# EAGLE design batoncircuit (EAGLE 7.1.0)
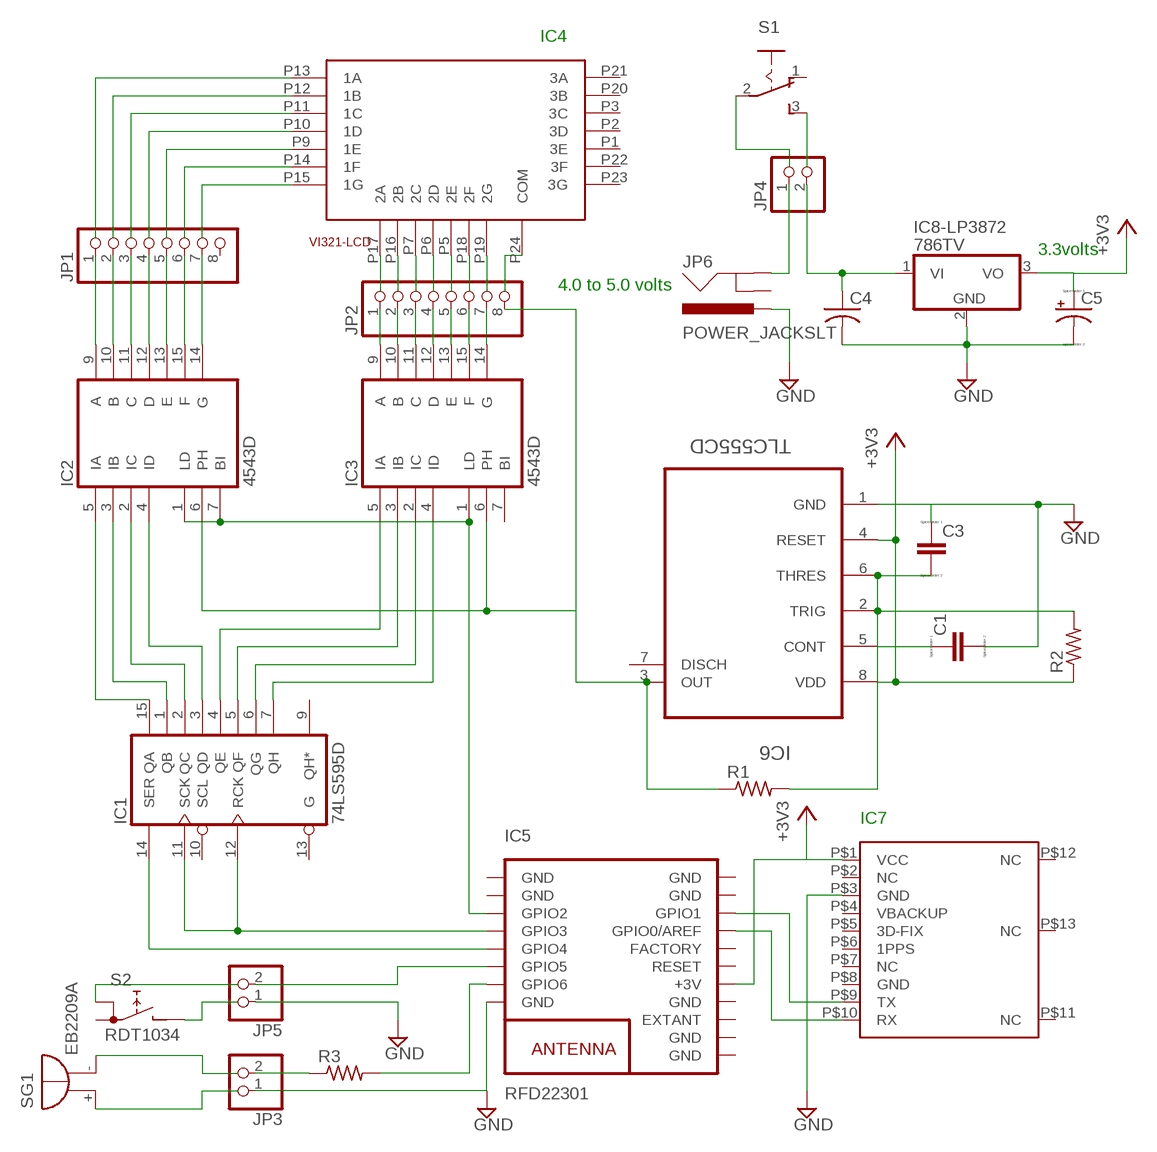
[diagram p0: schematic, sheet 1]

## Parts
C1  C-EU075-063X106  [C075-063X106]
C3  C-EUC1812  [C1812]
C4  C-US050-045X075  [C050-045X075]
C5  CPOL-USE5-10.5  [E5-10,5]
IC1  74LS595D  [SO16]
IC2  4543D  [SO16]
IC3  4543D  [SO16]
IC5  RFD22301  [RFD22301]
IC6  TLC555CD  [SOIC127P600X175-8N]
IC7  GPS_FGPMMOPA6C  [FGPMMOPA6C]
IC8-LP3872  786TV  [TO220V]
JP1  PINHD-1X8  [1X08]
JP2  PINHD-1X8  [1X08]
JP3  PINHD-1X2  [1X02]
JP4  PINHD-1X2  [1X02]
JP5  PINHD-1X2  [1X02]
JP6  POWER_JACKSLT  [POWER_JACK_SLOT]
R1  R-US_0207/10  [0207/10]
R2  R-US_0207/10  [0207/10]
R3  R-US_0207/12  [0207/12]
S1  255SB  [255SB]
S2  RDT1034  [RDT1034]
SG1  EB2209A  [EB2209A]
U8  V321-3DIGIT-LCD  [VI321-3DIGIT-LCD]

## Nets
+3V3: IC5.13(+3V) IC6.4(RESET) IC6.8(VDD) IC7.P$1(VCC) R2.1
GND: C1.2 C3.1 C4.2 C5.- IC5.8(GND) IC6.1(GND) IC7.P$3(GND) IC8-LP3872.2(GND) JP3.1 JP5.1 JP6.PWR
N$1: IC2.9(A) JP1.1
N$2: IC2.10(B) JP1.2
N$3: IC2.11(C) JP1.3
N$4: IC2.12(D) JP1.4
N$5: IC2.13(E) JP1.5
N$6: IC2.15(F) JP1.6
N$7: IC2.14(G) JP1.7
N$8: U8.P19(2G)
N$9: U8.P18(2F)
N$10: U8.P5(2E)
N$11: U8.P6(2D)
N$12: U8.P7(2C)
N$13: U8.P16(2B)
N$14: U8.P17(2A)
N$15: IC1.15(QA) IC2.5(IA)
N$16: IC1.1(QB) IC2.3(IB)
N$17: IC1.2(QC) IC2.2(IC)
N$18: IC1.3(QD) IC2.4(ID)
N$19: IC1.7(QH) IC3.4(ID)
N$20: IC1.6(QG) IC3.2(IC)
N$21: IC1.5(QF) IC3.3(IB)
N$22: IC1.4(QE) IC3.5(IA)
N$23: IC2.6(PH) IC3.6(PH) IC6.3(OUT) JP2.8 R1.1
N$24: IC1.14(SER) IC5.5(GPIO4)
N$25: C1.1 IC6.5(CONT)
N$26: IC5.16(GPIO0/AREF) IC7.P$10(RX)
N$27: C3.2 IC6.2(TRIG) IC6.6(THRES) R1.2 R2.2
N$28: IC5.17(GPIO1) IC7.P$9(TX)
N$29: IC2.1(LD) IC2.7(BI) IC3.1(LD) IC5.3(GPIO2)
N$30: JP3.2 R3.1
N$31: C4.1 IC8-LP3872.1(VI) JP4.2
N$32: IC5.7(GPIO6) R3.2
N$33: SG1.-
N$34: IC1.11(SCK) IC1.12(RCK) IC5.4(GPIO3)
N$35: U8.P24(COM)
N$36: IC3.14(G) JP2.7
N$37: IC3.15(F) JP2.6
N$38: IC3.13(E) JP2.5
N$39: IC3.12(D) JP2.4
N$40: IC3.11(C) JP2.3
N$41: IC3.10(B) JP2.2
N$42: IC3.9(A) JP2.1
N$43: U8.P13(1A)
N$44: U8.P12(1B)
N$45: U8.P11(1C)
N$46: U8.P10(1D)
N$47: U8.P9(1E)
N$48: U8.P14(1F)
N$49: U8.P15(1G)
N$50: SG1.+
N$51: C5.+ IC8-LP3872.3(VO)
N$52: JP4.1 JP6.GND@2(GND)
N$53: S1.3(S)
N$54: S1.2(P)
N$55: IC5.6(GPIO5) JP5.2
N$56: S2.B
N$57: S2.A
Unconnected: IC1.9(QH*) IC1.10(SCL) IC1.13(G) IC3.7(BI) IC5.11(EXTANT) IC5.14(RESET) IC5.15(FACTORY) IC6.7(DISCH) IC7.P$2(NC) IC7.P$4(VBACKUP) IC7.P$5(3D-FIX) IC7.P$6(1PPS) IC7.P$7(NC) IC7.P$8(GND) IC7.P$11(NC) IC7.P$12(NC) IC7.P$13(NC) JP1.8 JP6.GND@1(GNDBREAK) S1.1(O) S2.A1 U8.P1(3E) U8.P2(3D) U8.P3(3C) U8.P20(3B) U8.P21(3A) U8.P22(3F) U8.P23(3G)

## Notes on the sheet
- IC4
- 3.3volts
- 4.0 to 5.0 volts
- IC7

## Power pins joined to a net without a drawn wire
GND: IC1.8(GND) IC5.1(GND) IC5.2(GND) IC5.9(GND) IC5.10(GND) IC5.12(GND) IC5.18(GND) IC5.19(GND)
VCC: IC1.16(VCC)
VDD: IC2.16(VDD) IC3.16(VDD)
VSS: IC2.8(VSS) IC3.8(VSS)

## Library data of the parts
C1 C3 = resistor:C-EU: CAPACITOR, European symbol; SPICEPREFIX: C
C4 = resistor:C-US: CAPACITOR, American symbol
C5 = resistor:CPOL-US: POLARIZED CAPACITOR, American symbol
IC1 = 74xx-us:74*595: 8-bit SHIFT REGISTER, output latch
IC2 IC3 = 45xx:4543: BCD to 7-segment LCD DECODER
IC5 = RF_Digital_RFD22301_Eagle_Schematic_PCB_Library:RFD22301: RFD22301 RFduino SMT Module RFD22301 Datasheet: http://www.rfdigital.com/wp-content/uploads/2014/03/RFD22301.Data_.Sheet_.11.24.13_11.38PM.pdf
IC6 = Texas Instruments_By_element14_Batch_1:TLC555CD: LINCMOS TIMER; MPN: TLC555CD; OC_FARNELL: 1106128; OC_NEWARK: 67K1265; PACKAGE: SOIC-8; SUPPLIER: Texas Instruments
IC7 = adafruit:GPS_FGPMMOPA6C: FGPMMOPA6C 16x16 GPS Module NMEA Sentences: GGA, GSA, GSV, RMC, VTG
IC8-LP3872 = linear:78*: Positive VOLTAGE REGULATOR Source: http://cache.national.com/ds/LM/LM78L05.pdf http://www.fairchildsemi.com/ds/LM/LM7805.pdf
JP1 JP2 = pinhead:PINHD-1X8: PIN HEADER
JP3-JP5 = pinhead:PINHD-1X2: PIN HEADER
JP6 = SparkFun-Connectors:POWER_JACK: Power Jack This is the standard 5.5mm barrel jack for power. The PTH is the most common, proven, reliable, footprint. The Slot footprint only works if the mill layer is transmitted to the PCB fab house so be warned. Mating wall wart : TOL-00298 (and others); PROD_ID: PRT-00119
R1-R3 = resistor:R-US_: RESISTOR, American symbol
S1 = switch:255SB: SLIDING SWITCH Distributor Buerklin, 11G810
S2 = switch:RDT1034: PUSH SWITCH www.radiohm.com
SG1 = buzzer:EB2209A: BUZZER Source: Buerklin
U8 = vi321lcd:V321-3DIGIT-LCD

## Board
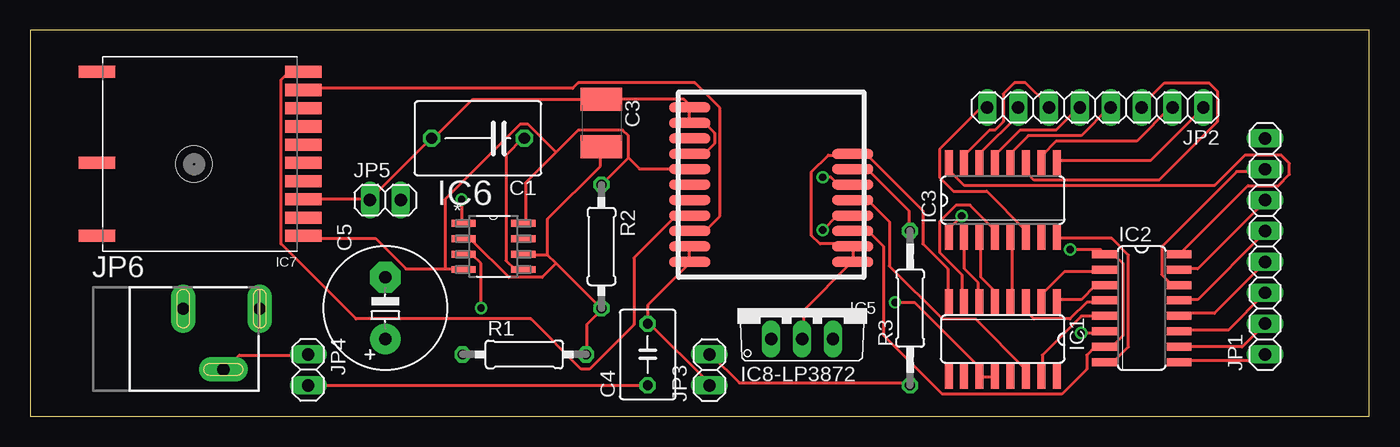
[diagram p1: board, top side]
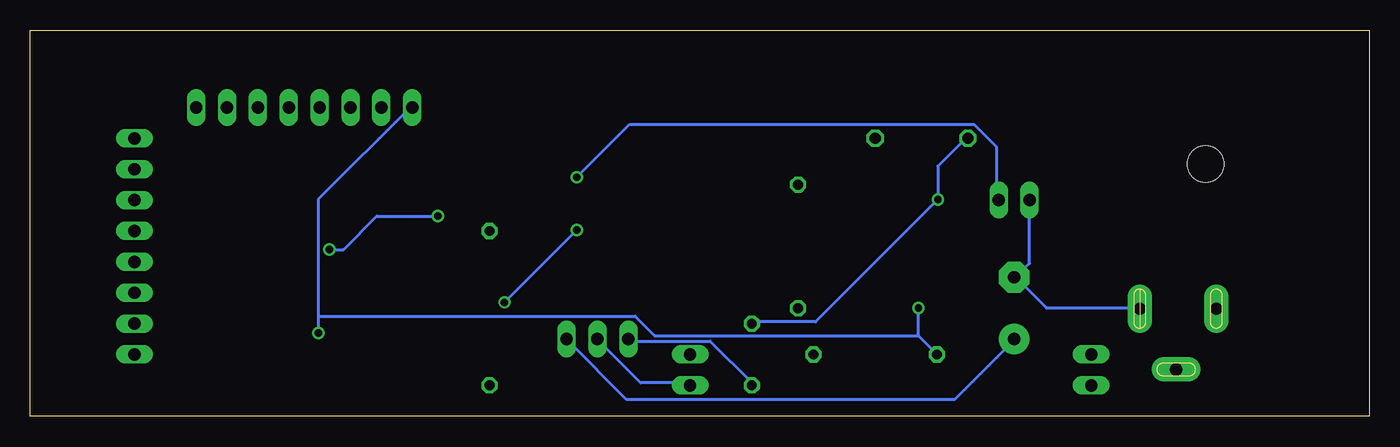
[diagram p2: board, bottom side, seen from below]

Size 110.16 x 31.74 mm. Coordinates in mm from the lower left corner, seen from the top.
Outline: 0,0 110.16,0 110.16,31.74 0,31.74 0,0
Copper layers (1*16): Top 0.035mm / dielectric 1.5mm / Bottom 0.035mm
Design rules "default": minimum track width 10mil, minimum drill 24mil, track to track 8mil, track to pad 8mil, pad to pad 8mil, via to via 8mil, smd to smd 8mil, copper to edge 40mil, drill to drill 8mil, minimum pad ring 10mil, minimum via ring 8mil, stop-mask expansion 4mil, vias tented up to drill 0mil, thermal gap 10mil

### Footprints (pad centres in the part's own frame; a part is rotated, then mirrored left to right if it is on the bottom)
C075-063X106 = drill 0.914 octagon: 1 -3.81,0; 2 3.81,0
C1812 = smd 1.9 x 3.4: 1 -1.95,0; 2 1.95,0
C050-045X075 = drill 0.813 octagon: 1 -2.54,0; 2 2.54,0
E5-10,5 = drill 1.016 pad 2.54: + -2.54,0 | drill 1.016 pad 2.54 octagon: - 2.54,0
SO16 = smd 0.66 x 2.032: 1 -4.445,-3.073; 2 -3.175,-3.073; 3 -1.905,-3.073; 4 -0.635,-3.073; 5 0.635,-3.073; 6 1.905,-3.073; 7 3.175,-3.073; 8 4.445,-3.073; 9 4.445,3.073; 10 3.175,3.073; 11 1.905,3.073; 12 0.635,3.073; 13 -0.635,3.073; 14 -1.905,3.073; 15 -3.175,3.073; 16 -4.445,3.073
RFD22301 = smd 3.353 x 0.813: 1 -6.706,7.62; 2 -6.706,6.35; 3 -6.706,5.08; 4 -6.706,3.81; 5 -6.706,2.54; 6 -6.706,1.27; 7 -6.706,0; 8 -6.706,-1.27; 9 6.706,-5.08; 10 6.706,-3.81; 11 6.706,-2.54; 12 6.706,-1.27; 13 6.706,0; 14 6.706,1.27; 15 6.706,2.54; 16 6.706,3.81; 17 6.706,5.08; 18 6.706,6.35; 19 6.706,7.62
SOIC127P600X175-8N = smd 1.981 x 0.559: 1 -2.464,1.905; 2 -2.464,0.635; 3 -2.464,-0.635; 4 -2.464,-1.905; 5 2.464,-1.905; 6 2.464,-0.635; 7 2.464,0.635; 8 2.464,1.905
FGPMMOPA6C = smd 3 x 1: P$1 -8.5,6.75; P$2 -8.5,5.25; P$3 -8.5,3.75; P$4 -8.5,2.25; P$5 -8.5,0.75; P$6 -8.5,-0.75; P$7 -8.5,-2.25; P$8 -8.5,-3.75; P$9 -8.5,-5.25; P$10 -8.5,-6.75; P$11 8.5,-6.75; P$12 8.5,0.75; P$13 8.5,6.75 | hole 3: 0.5,0.85
TO220V = drill 1.016 long: 1 -2.54,-2.54; 2 0,-2.54; 3 2.54,-2.54
1X08 = drill 1.016 long: 1 -8.89,0; 2 -6.35,0; 3 -3.81,0; 4 -1.27,0; 5 1.27,0; 6 3.81,0; 7 6.35,0; 8 8.89,0
1X02 = drill 1.016 long: 1 -1.27,0; 2 1.27,0
POWER_JACK_SLOT = drill 1 pad 2 long: GND@1 2.58,7.5; GND@2 7.58,10.8; PWR 2.58,13.8
0207/10 = drill 0.813 octagon: 1 -5.08,0; 2 5.08,0
0207/12 = drill 0.813 octagon: 1 -6.35,0; 2 6.35,0
255SB = drill 1.118 long: 1 -3.81,0; 2 0,0; 3 3.81,0
RDT1034 = drill 0.8: A 3.175,-0.635; A1 -3.175,0.635; B 0.65,1.9
EB2209A = drill 1.321 pad 2.54 octagon: + 7.493,0; - -7.493,0
VI321-3DIGIT-LCD = drill 0.8: P1 -13.97,-10.795; P2 -11.43,-10.795; P3 -8.89,-10.795; P4 -6.35,-10.795; P5 -3.81,-10.795; P6 -1.27,-10.795; P7 1.27,-10.795; P8 3.81,-10.795; P9 6.35,-10.795; P10 8.89,-10.795; P11 11.43,-10.795; P12 13.97,-10.795; P13 13.97,10.795; P14 11.43,10.795; P15 8.89,10.795; P16 6.35,10.795; P17 3.81,10.795; P18 1.27,10.795; P19 -1.27,10.795; P20 -3.81,10.795; P21 -6.35,10.795; P22 -8.89,10.795; P23 -11.43,10.795; P24 -13.97,10.795

### Placement (x,y rotation side)
C1  36.83,22.86 180 top
C3  46.99,24.13 270 top
C4  50.8,5.08 90 top
C5  29.21,8.89 90 top
IC1  80.01,6.35 180 top
IC2  91.44,8.89 270 top
IC3  80.01,17.78 0 top
IC5  60.96,20.32 180 top
IC6  38.1,13.97 0 top
IC7  13.97,21.59 180 top
IC8-LP3872  63.5,8.89 0 top
JP1  101.6,13.97 90 top
JP2  87.63,25.4 180 top
JP3  55.88,3.81 90 top
JP4  22.86,3.81 270 top
JP5  29.21,17.78 0 top
JP6  5.08,11.43 270 top
R1  40.64,5.08 0 top
R2  46.99,13.97 270 top
R3  72.39,8.89 90 top
S1  38.1,48.26 90 top  (outside the outline)
S2  50.8,48.26 0 top  (outside the outline)
SG1  16.51,48.26 0 top  (outside the outline)
U8  83.82,50.8 0 top  (outside the outline)

### Tracks (layer width: path | path; a pad name or v marks a point on that pad's centre or on a via)
+3V3
  Top 0.254: 34.11,12.12 30.91,12.12 28.4,14.63 22.68,14.63 IC7.P$1 | 34.11,12.12 35.48,12.12 IC6.4 | 43.26,21.72 45.09,23.55 48.74,23.55 49.2,23.09 49.2,21.26 | 43.26,21.72 40.74,19.2 40.74,16 IC6.8 | R2.1 49.2,21.26 | 49.2,21.26 50.11,20.34 54.23,20.34 IC5.13 | 34.11,12.12 34.11,17.83 40.28,24 40.97,24 43.26,21.72
GND  (via drill 0.61)
  Top 0.254: IC1.8 75.49,9.6 75.49,12.12 73.43,14.17 73.43,16.92 68.86,21.49 67.72,21.49 IC5.8 67.49,21.49 65.66,21.49 64.29,20.12 64.29,14.86 64.97,14.17 67.49,14.17 IC5.2 67.72,13.95 67.72,12.8 IC5.1 67.49,12.57 63.6,8.69 63.6,6.4 IC8-LP3872.2 | 50.8,7.77 50.8,9.14 54.23,12.57 IC5.19 54.23,12.8 54.23,13.95 IC5.18 | 50.8,7.77 55.83,2.74 JP3.1 | 50.8,7.77 C4.2 | IC5.12 54.46,21.72 55.6,21.72 56.29,22.4 56.29,23.32 55.6,24 54.46,24 IC5.10 54.23,24.23 54.23,25.38 IC5.9 54.23,25.6 53.77,26.06 47.14,26.06 C3.1 46.91,26.06 36.4,26.06 33.2,22.86 C1.2 32.97,22.86 27.94,17.83 | v35.48,17.83 35.48,16 IC6.1 | 27.94,17.83 22.68,17.83 IC7.P$3 | 27.94,17.83 JP5.1
  Bottom 0.254: IC8-LP3872.2 63.37,6.17 59.94,2.74 56.06,2.74 JP3.1 | C1.2 33.2,22.86 35.48,20.57 v35.48,17.83 45.54,7.77 50.8,7.77 C4.2 | 29.08,11.43 26.57,8.91 19.02,8.91 JP6.PWR | JP5.1 27.94,12.57 29.08,11.43 | 29.08,11.43 C5.-
N$1
  Top 0.254: JP1.1 101.09,4.57 94.69,4.57 IC2.9
N$2
  Top 0.254: IC2.10 99.72,5.71 101.55,7.54 JP1.2
N$3
  Top 0.254: IC2.11 94.69,7.09 98.58,7.09 101.55,10.06 JP1.3
N$4
  Top 0.254: IC2.12 94.69,8.46 97.43,8.46 101.55,12.57 JP1.4
N$5
  Top 0.254: IC2.13 94.69,9.6 96.06,9.6 101.55,15.09 JP1.5
N$6
  Top 0.254: IC2.15 94.69,12.12 96.06,12.12 101.55,17.6 JP1.6
N$7
  Top 0.254: IC2.14 94.46,10.97 93.78,10.97 93.09,11.66 93.09,13.95 99.26,20.12 101.55,20.12 JP1.7
N$15
  Top 0.254: IC1.15 83.26,3.43 83.26,5.03 86.46,8.23 88.29,8.23 IC2.5
N$16
  Top 0.254: IC1.1 84.63,9.6 86.46,9.6 87.61,10.74 88.29,10.74 IC2.3
N$17
  Top 0.254: IC1.2 83.26,9.6 83.26,10.06 85.09,11.89 88.29,11.89 IC2.2
N$18
  Top 0.254: IC1.3 82.12,9.37 82.12,8.46 82.58,8 85.55,8 86.92,9.37 88.29,9.37 IC2.4
N$19
  Top 0.254: IC3.4 79.38,15.32 77.32,17.37 76.17,17.37 74.8,16 74.8,13.49 76.63,11.66 76.63,9.6 IC1.7
N$20
  Top 0.254: IC3.2 76.86,14.63 76.86,12.12 78,10.97 78,9.6 IC1.6
N$21
  Top 0.254: IC1.5 79.38,10.29 78.23,11.43 78.23,14.63 IC3.3
N$22
  Top 0.254: IC1.4 80.75,9.6 80.75,14.63 IC3.5
N$23  (via drill 0.61)
  Top 0.254: v37.08,8.91 37.08,12.57 36.4,13.26 35.71,13.26 IC6.3 | v86.46,6.86 88.29,6.86 IC2.6 | IC3.6 81.89,14.86 81.89,15.32 78.69,18.52 75.95,18.52 74.8,19.66 74.8,21.95 78.23,25.38 78.69,25.38 JP2.8
  Bottom 0.254: 37.08,6.63 v37.08,8.91 | 37.08,6.63 35.71,5.26 R1.1 | 86.46,8.23 86.46,17.83 78.92,25.38 JP2.8 | 86.46,8.23 v86.46,6.86 | 37.08,6.63 58.8,6.63 60.4,8.23 86.46,8.23
N$24
  Top 0.254: IC1.14 81.89,3.43 81.89,3.89 77.77,8 75.03,8 70.69,12.34 70.69,16 69.09,17.6 67.72,17.6 IC5.5
N$25
  Top 0.254: IC6.5 40.51,12.12 39.83,12.12 39.14,12.8 39.14,21.49 40.51,22.86 C1.1
N$26
  Top 0.254: IC7.P$10 22.45,28.12 21.08,28.12 20.62,27.66 20.62,14.17 26.8,8 41.2,8 45.31,3.89 46,3.89 49.66,7.54 49.66,13.03 53.09,16.46 54.23,16.46 IC5.16
N$27
  Top 0.254: 42.57,13.26 40.74,13.26 IC6.6 | 43.26,12.57 46.91,8.91 R2.2 46.91,8.69 45.77,7.54 45.77,5.26 R1.2 | 43.26,12.57 42.57,13.26 | 43.26,12.57 42.11,11.43 39.37,11.43 36.4,14.4 35.71,14.4 IC6.2 | 42.57,13.26 42.57,16.23 46.91,20.57 46.91,22.17 C3.2
N$28
  Top 0.254: IC7.P$9 22.68,26.98 44.63,26.98 45.09,27.43 54.69,27.43 56.74,25.38 56.74,16.46 55.6,15.32 54.46,15.32 IC5.17
N$29  (via drill 0.61)
  Top 0.254: v76.63,16.46 75.72,15.54 75.72,14.86 IC3.1 | v85.55,13.72 88.06,13.72 88.29,13.49 IC2.1 88.52,13.26 89.2,13.26 89.89,12.57 89.89,6.63 88.98,5.71 IC2.7 87.61,5.71 86.92,5.03 86.92,3.89 84.86,1.83 75.03,1.83 70.23,6.63 70.23,13.95 69.09,15.09 67.72,15.09 IC5.3
  Bottom 0.254: v76.63,16.46 81.66,16.46 84.4,13.72 v85.55,13.72
N$30
  Top 0.254: R3.1 72.29,2.74 58.34,2.74 56.06,5.03 JP3.2
N$31
  Top 0.254: JP4.2 22.91,2.52 50.8,2.52 C4.1
  Bottom 0.254: C4.1 50.8,2.74 54.23,6.17 60.86,6.17 IC8-LP3872.1
N$32
  Top 0.254: R3.2 72.29,15.32 72.29,16.92 69.09,20.12 67.72,20.12 IC5.7
N$34  (via drill 0.61)
  Top 0.254: IC1.12 79.38,3.2 78.23,3.2 IC1.11 78,3.43 78,4.12 72.75,9.37 v71.14,9.37 | v65.2,15.32 66.34,16.46 67.49,16.46 IC5.4
  Bottom 0.254: v65.2,15.32 v71.14,9.37
N$36
  Top 0.254: IC3.14 78.23,21.03 78.23,21.72 81.2,24.69 81.2,25.38 JP2.7
N$37
  Top 0.254: IC3.15 76.86,21.03 76.86,21.49 78.92,23.55 79.38,23.55 80.06,24.23 80.06,26.52 80.97,27.43 81.89,27.43 83.72,25.6 JP2.6
N$38
  Top 0.254: IC3.13 79.38,21.49 81.43,23.55 84.4,23.55 86.23,25.38 JP2.5
N$39
  Top 0.254: IC3.12 80.75,21.03 80.75,21.72 82.12,23.09 86.46,23.09 88.75,25.38 JP2.4
N$40
  Top 0.254: IC3.11 82.12,20.8 82.12,19.89 82.58,19.43 92.86,19.43 97.66,24.23 97.66,26.75 96.98,27.43 93.32,27.43 91.49,25.6 JP2.3
N$41
  Top 0.254: IC3.10 83.26,21.03 83.26,21.49 84.4,22.63 91.03,22.63 93.78,25.38 JP2.2
N$42
  Top 0.254: IC3.9 84.63,21.03 92.18,21.03 96.52,25.38 JP2.1
N$51
  Bottom 0.254: IC8-LP3872.3 65.89,6.17 61.09,1.37 34.11,1.37 29.31,6.17 C5.+
N$52
  Top 0.254: JP4.1 22.68,5.03 17.2,5.03 16.05,3.89 JP6.GND@2
N$55  (via drill 0.61)
  Top 0.254: v65.2,19.66 65.89,19.66 66.34,19.2 67.49,19.2 IC5.6
  Bottom 0.254: v65.2,19.66 60.86,24 32.51,24 30.68,22.17 30.68,17.83 JP5.2
VDD
  Top 0.254: IC3.16 75.72,20.8 75.72,20.12 76.86,18.97 97.43,18.97 99.95,21.49 102.92,21.49 103.61,20.8 103.61,19.89 102.69,18.97 100.18,18.97 94.69,13.49 IC2.16
VSS
  Top 0.254: IC3.8 84.63,14.63 88.98,14.63 90.35,13.26 90.35,5.71 89.2,4.57 88.52,4.57 IC2.8